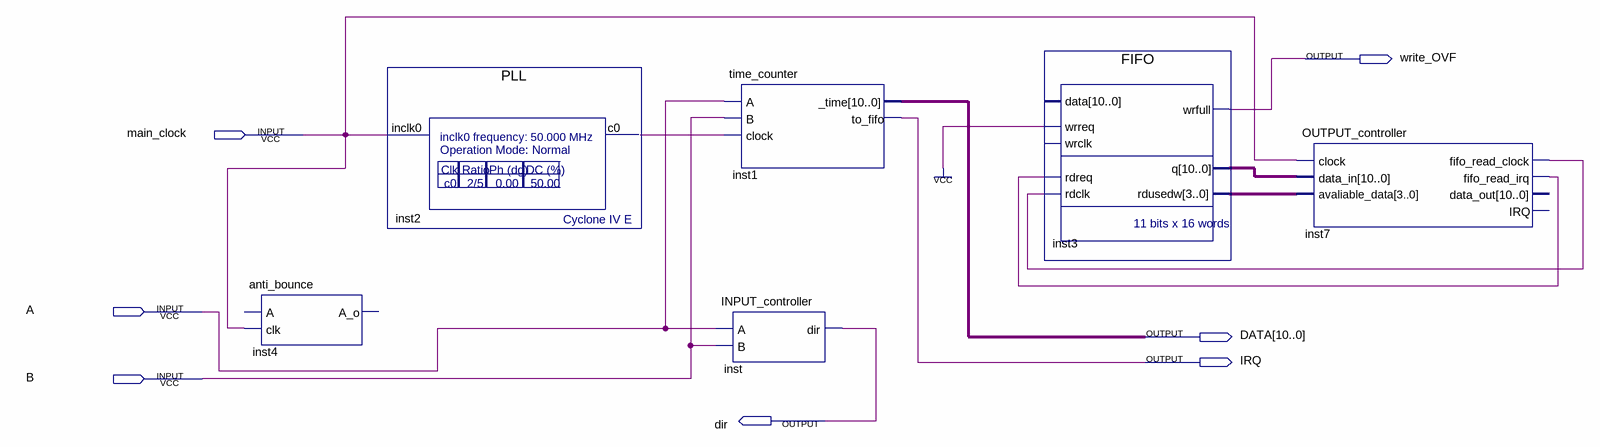
[diagram p0: schematic sheet]
// Quartus schematic Data_Acquisition_System.bdf as structural Verilog: 6 symbols, 7 pins
module Data_Acquisition_System (
  input  main_clock,
  input  A,
  input  B,
  output write_OVF,
  output [10:0] DATA,
  output IRQ,
  output dir
);

  wire inst2_c0, inst7_fifo_read_clock, inst7_fifo_read_irq;
  wire [3:0] inst3_rdusedw;
  wire [10:0] inst3_q;

  anti_bounce inst4 (.clk(main_clock));  // open: A, A_o
  PLL inst2 (.inclk0(main_clock), .c0(inst2_c0));
  time_counter inst1 (.A(A), .B(B), .clock(inst2_c0), ._time(DATA), .to_fifo(IRQ));
  INPUT_controller inst (.A(A), .B(B), .dir(dir));
  FIFO inst3 (
    .wrreq(1'b1), .rdreq(inst7_fifo_read_irq), .rdclk(inst7_fifo_read_clock), .wrfull(write_OVF),
    .q(inst3_q), .rdusedw(inst3_rdusedw));  // open: data, wrclk
  OUTPUT_controller inst7 (
    .clock(main_clock), .data_in(inst3_q), .avaliable_data(inst3_rdusedw),
    .fifo_read_clock(inst7_fifo_read_clock), .fifo_read_irq(inst7_fifo_read_irq));  // open: data_out, IRQ
endmodule
